# EAGLE design opencoral_moonlight (EAGLE 6.5.0)
TITLE: OpenCoral Luna Moonlight Strip
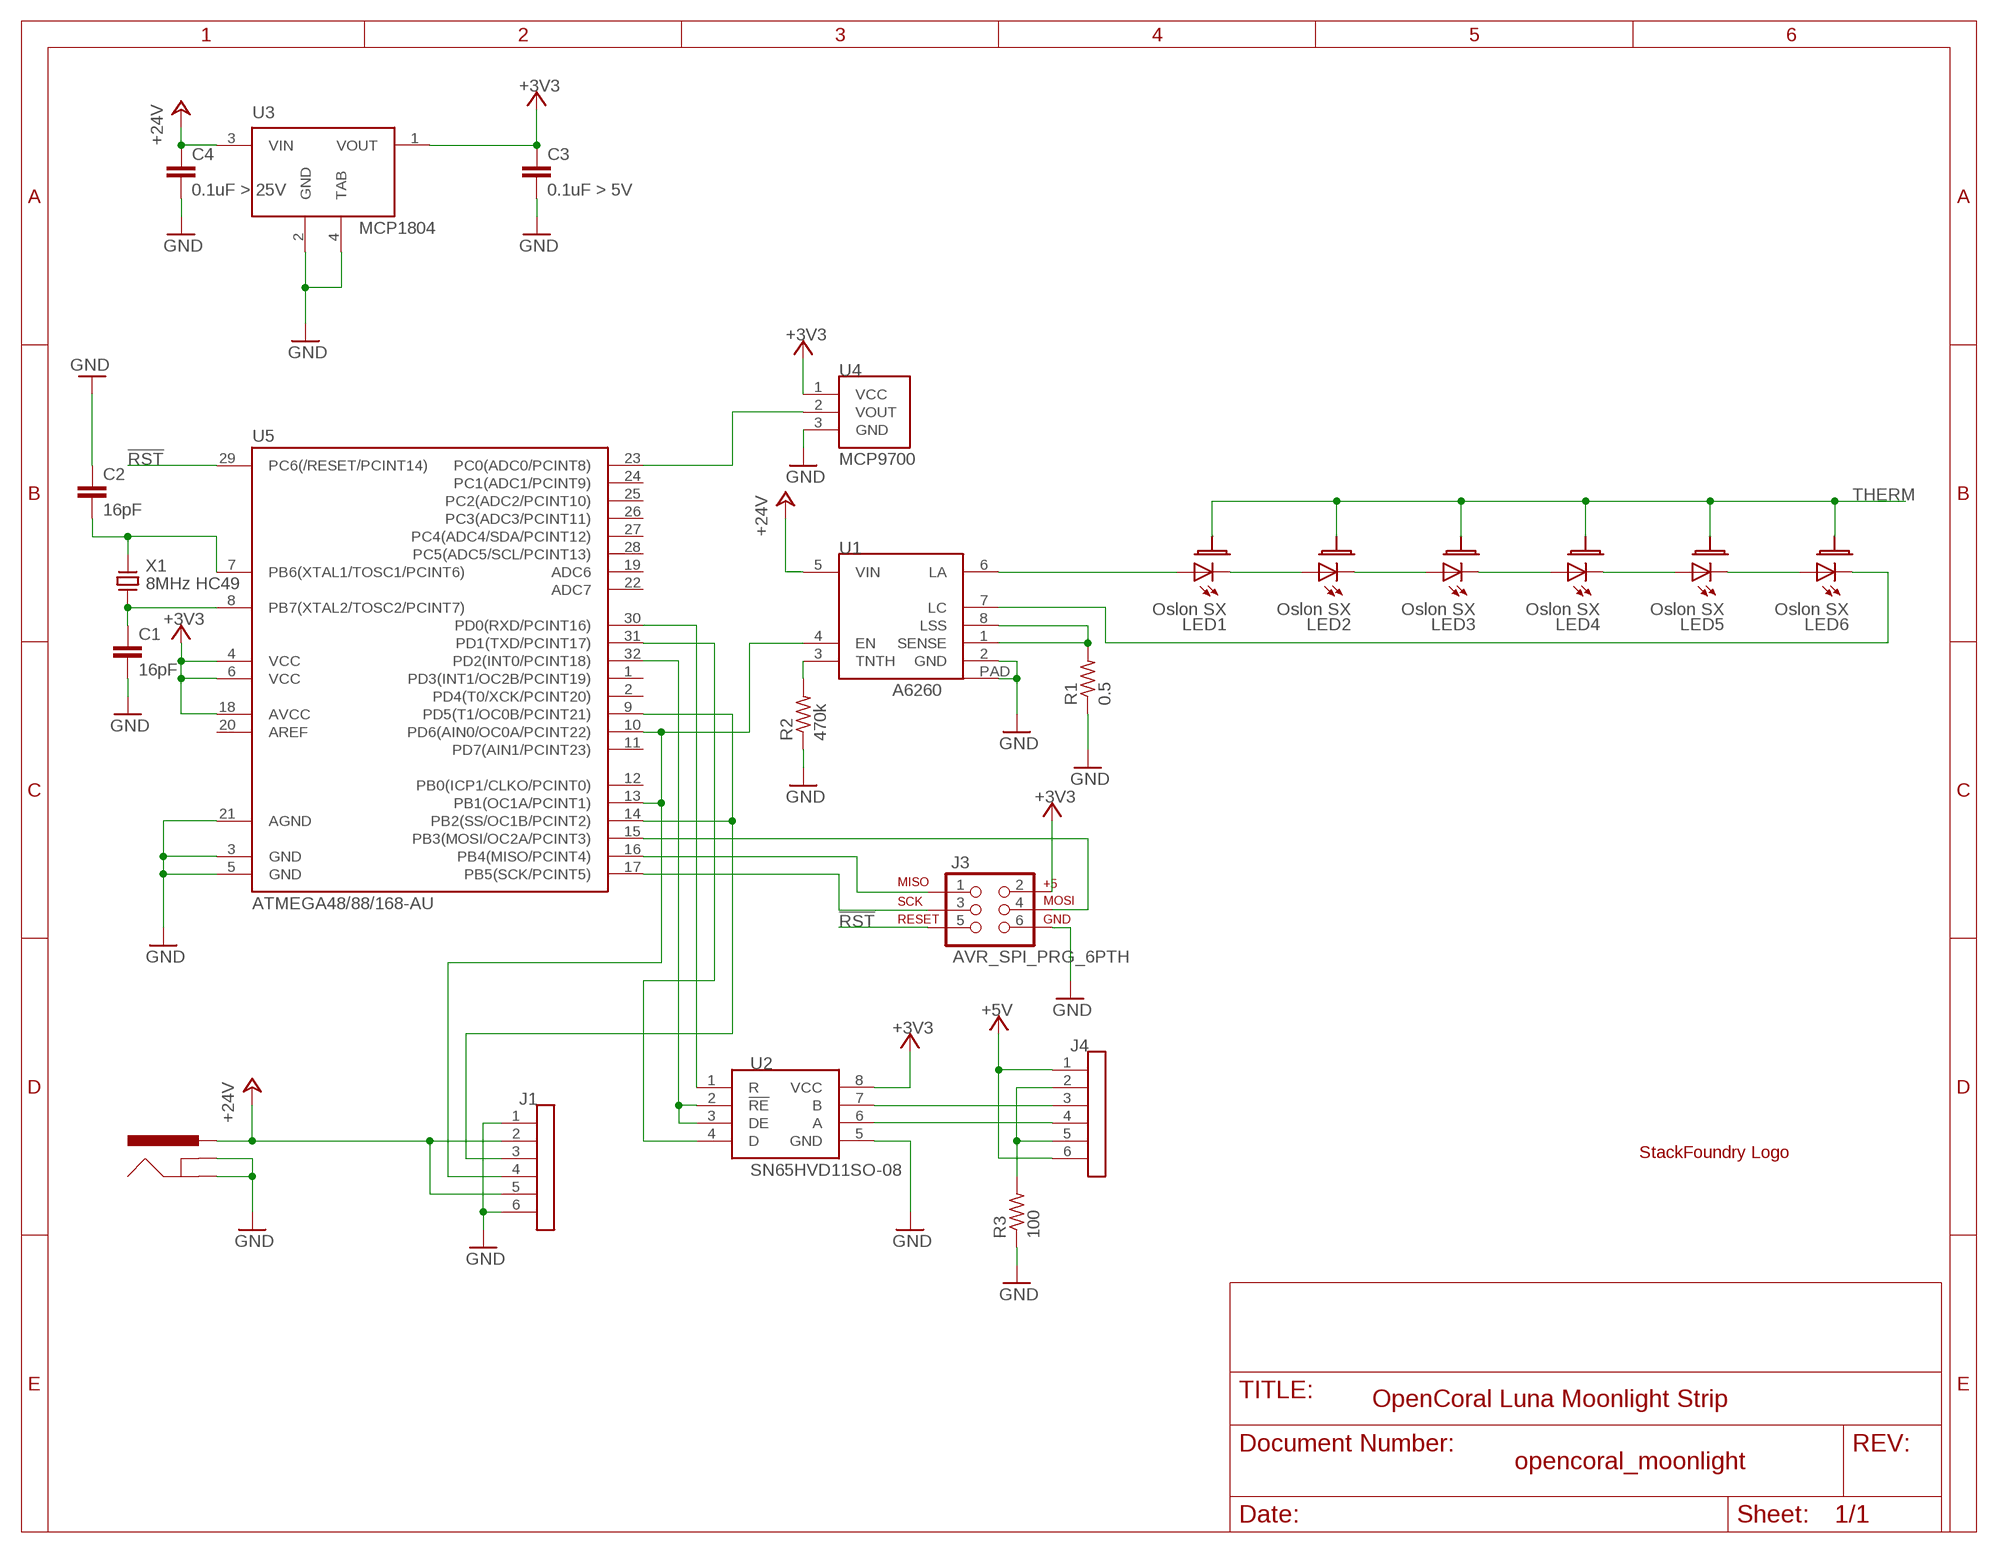
[diagram p0: schematic, sheet 1]

## Parts
C1  16pF  C-EUC0603  [C0603]
C2  16pF  C-EUC0603  [C0603]
C3  0.1uF > 5V  C-EUC0603  [C0603]
C4  0.1uF > 25V  C-EUC0603  [C0603]
J1  RJ12  [A-2004-RJ12]
J2  POWER_JACKPTH  [POWER_JACK_PTH]
J3  AVR_SPI_PRG_6PTH  [2X3]
J4  RJ12  [A-2004-RJ12]
LED1  Oslon SX  LEDOSLON_SX  [OSRAM_OSLON_SX]
LED2  Oslon SX  LEDOSLON_SX  [OSRAM_OSLON_SX]
LED3  Oslon SX  LEDOSLON_SX  [OSRAM_OSLON_SX]
LED4  Oslon SX  LEDOSLON_SX  [OSRAM_OSLON_SX]
LED5  Oslon SX  LEDOSLON_SX  [OSRAM_OSLON_SX]
LED6  Oslon SX  LEDOSLON_SX  [OSRAM_OSLON_SX]
LOGO1  SFLOGO  [SFLOGO]
R1  0.5  R-US_R0805  [R0805]
R2  470k  R-US_R0603  [R0603]
R3  100  R-US_R0603  [R0603]
U1  A6260  [ESOIC-8]
U2  SN65HVD11SO-08  [SO-08]
U3  MCP1804  [SOT223-3]
U4  MCP9700  [SOT23]
U5  ATMEGA48/88/168-AU  [TQFP32-08]
X1  8MHz HC49  HCM49_18.432M  [HCM49]

## Nets
!RST: J3.5 U5.29(PC6(/RESET/PCINT14))
+3V3: C3.1 J3.2 U2.8(VCC) U3.1(VOUT) U4.1(VCC) U5.4(VCC) U5.6(VCC) U5.18(AVCC)
+5V: J4.1 J4.6
+24V: C4.1 J1.2 J1.5 J2.PWR U1.5(VIN) U3.3(VIN)
GND: C1.2 C2.1 C3.2 C4.2 J1.1 J1.6 J2.GND J2.GNDBREAK J3.6 R1.1 R2.1 R3.1 U1.2(GND) U1.PAD U2.5(GND) U3.2(GND) U3.4(TAB) U4.3(GND) U5.3(GND) U5.5(GND) U5.21(AGND)
N$1: LED1.A U1.6(LA)
N$2: LED1.C LED2.A
N$3: LED2.C LED3.A
N$4: LED3.C LED4.A
N$5: LED4.C LED5.A
N$6: LED5.C LED6.A
N$7: LED6.C U1.7(LC)
N$8: J1.4 U1.4(EN) U5.10(PD6(AIN0/OC0A/PCINT22)) U5.13(PB1(OC1A/PCINT1))
N$9: U2.4(D) U5.31(PD1(TXD/PCINT17))
N$10: U2.1(R) U5.30(PD0(RXD/PCINT16))
N$11: R1.2 U1.1(SENSE) U1.8(LSS)
N$12: U2.2(!RE) U2.3(DE) U5.32(PD2(INT0/PCINT18))
N$13: J4.3 U2.7(B)
N$14: J4.4 U2.6(A)
N$15: R2.2 U1.3(TNTH)
N$16: J1.3 U5.9(PD5(T1/OC0B/PCINT21)) U5.14(PB2(SS/OC1B/PCINT2))
N$17: J3.4 U5.15(PB3(MOSI/OC2A/PCINT3))
N$18: J3.1 U5.16(PB4(MISO/PCINT4))
N$19: J3.3 U5.17(PB5(SCK/PCINT5))
N$20: C2.2 U5.7(PB6(XTAL1/TOSC1/PCINT6)) X1.P$1
N$21: C1.1 U5.8(PB7(XTAL2/TOSC2/PCINT7)) X1.P$2
N$22: U4.2(VOUT) U5.23(PC0(ADC0/PCINT8))
N$23: J4.2 J4.5 R3.2
THERM: LED1.THERM LED2.THERM LED3.THERM LED4.THERM LED5.THERM LED6.THERM
Unconnected: U5.1(PD3(INT1/OC2B/PCINT19)) U5.2(PD4(T0/XCK/PCINT20)) U5.11(PD7(AIN1/PCINT23)) U5.12(PB0(ICP1/CLKO/PCINT0)) U5.19(ADC6) U5.20(AREF) U5.22(ADC7) U5.24(PC1(ADC1/PCINT9)) U5.25(PC2(ADC2/PCINT10)) U5.26(PC3(ADC3/PCINT11)) U5.27(PC4(ADC4/SDA/PCINT12)) U5.28(PC5(ADC5/SCL/PCINT13))

## Library data of the parts
C1-C4 = rcl:C-EU: CAPACITOR, European symbol
J1 J4 = con-jack:RJ12
J2 = SparkFun:POWER_JACK: Power Jack This is the standard 5.5mm barrel jack for power. The PTH is the most common, proven, reliable, footprint. All others are experimental. The Slot footprint only works if the mill layer is transmitted to the PCB fab house so be warned. Spark Fun Electronics SKU : PRT-00119. Mating wall wart : TOL-00298 (and others)
J3 = SparkFun:AVR_SPI_PRG_6: AVR ISP 6 Pin This is the reduced ISP connector for AVR programming. Common on Arduino. This footprint will take up less PCB space and can be used with a 10-pin to 6-pin adapter such as SKU: BOB-08508
LED1-LED6 = high-power-led:LED
LOGO1 = logos:SFLOGO
R1-R3 = rcl:R-US_: RESISTOR, American symbol
U1 = allegro:A6260: Allegro A6260 Power LED Driver 350mA maximum output
U2 = texas:SN65HVD11: 3.3V RS-485 Transceiver, Half-Duplex
U3 = microchip:MCP1804
U4 = microchip:MCP9700: MCP9700 series temperature sensors -40-125C
U5 = atmel:ATMEGA48/88/168
X1 = xtal:HCM49_18.432M: 18.432 MHz SMD Crystal

## Board
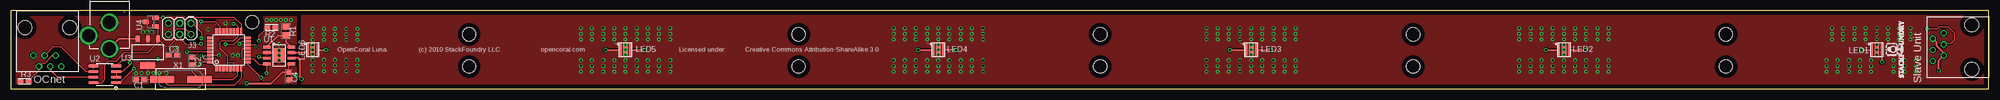
[diagram p1: board, top side]
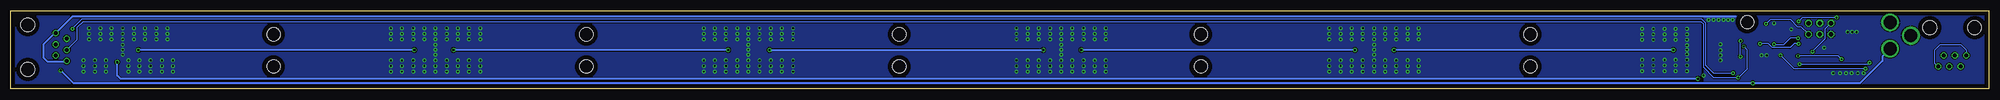
[diagram p2: board, bottom side, seen from below]

Size 449.58 x 17.78 mm. Coordinates in mm from the lower left corner, seen from the top.
Outline: 0,0 449.58,0 449.58,17.78 0,17.78 0,0
Copper layers (1*16): Top 0.035mm / dielectric 1.5mm / Bottom 0.035mm
Design rules "default *": minimum track width 10mil, minimum drill 15mil, track to track 8mil, track to pad 8mil, pad to pad 8mil, via to via 8mil, smd to smd 8mil, copper to edge 40mil, drill to drill 8mil, minimum pad ring 10mil, minimum via ring 8mil, stop-mask expansion 4mil, vias tented up to drill 15mil, thermal gap 10mil
Holes 3.05 mm at 54.86,15.24 104.14,12.45 179.07,5.08 247.65,12.45 318.77,5.08 389.89,12.45 389.89,5.08 104.14,5.08 179.07,12.45 247.65,5.08 318.77,12.45

### Footprints (pad centres in the part's own frame; a part is rotated, then mirrored left to right if it is on the bottom)
C0603 = smd 1.1 x 1: 1 -0.85,0; 2 0.85,0
A-2004-RJ12 = drill 0.9: 1 -5.08,0; 2 -3.81,-2.54; 3 -2.54,0; 4 -1.27,-2.54; 5 0,0; 6 1.27,-2.54 | hole 3.2: -6.99,-8.89; 3.18,-8.89
POWER_JACK_PTH = drill 2.997: GND 0,7.7; GNDBREAK 4.7,10.7; PWR 0,13.7
2X3 = drill 1.016 octagon: 1 0,0; 2 0,2.54; 3 2.54,0; 4 2.54,2.54; 5 5.08,0; 6 5.08,2.54
OSRAM_OSLON_SX = smd 2.8 x 0.55: A 0,-1.15; C 0,1.15 | smd 2.8 x 1: THERM 0,0
R0805 = smd 1.3 x 1.5: 1 -0.95,0; 2 0.95,0
R0603 = smd 1.1 x 1: 1 -0.85,0; 2 0.85,0
ESOIC-8 = smd 0.65 x 1.75: 1 -1.905,-2.8; 2 -0.635,-2.8; 3 0.635,-2.8; 4 1.905,-2.8; 5 1.905,2.8; 6 0.635,2.8; 7 -0.635,2.8; 8 -1.905,2.8 | smd 3.3 x 2.41: PAD 0,0
SO-08 = smd 0.6 x 2.2: 1 -1.905,-2.6; 2 -0.635,-2.6; 3 0.635,-2.6; 4 1.905,-2.6; 5 1.905,2.6; 6 0.635,2.6; 7 -0.635,2.6; 8 -1.905,2.6
SOT223-3 = smd 0.85 x 1.4: 1 -2.3,-3.04; 2 0,-3.04; 3 2.3,-3.04 | smd 3.4 x 1.6: 4 0,3.04
SOT23 = smd 1 x 1.4: 1 -0.95,-1.1; 2 0.95,-1.1; 3 0,1.1
TQFP32-08 = smd 1.27 x 0.559: 1 -4.293,2.8; 2 -4.293,2; 3 -4.293,1.2; 4 -4.293,0.4; 5 -4.293,-0.4; 6 -4.293,-1.2; 7 -4.293,-2; 8 -4.293,-2.8; 17 4.293,-2.8; 18 4.293,-2; 19 4.293,-1.2; 20 4.293,-0.4; 21 4.293,0.4; 22 4.293,1.2; 23 4.293,2; 24 4.293,2.8 | smd 0.559 x 1.27: 9 -2.8,-4.293; 10 -2,-4.293; 11 -1.2,-4.293; 12 -0.4,-4.293; 13 0.4,-4.293; 14 1.2,-4.293; 15 2,-4.293; 16 2.8,-4.293; 25 2.8,4.293; 26 2,4.293; 27 1.2,4.293; 28 0.4,4.293; 29 -0.4,4.293; 30 -1.2,4.293; 31 -2,4.293; 32 -2.8,4.293
HCM49 = smd 5.5 x 1.5: P$1 -4.25,0; P$2 4.25,0

### Placement (x,y rotation side)
C1  29.34,2.16 180 top
C2  41.15,6.35 270 top
C3  36.83,7.62 0 top
C4  63.12,2.92 270 top
J1  436.88,11.43 90 top
J2  22.35,22.86 180 top
J3  40.89,14.99 180 top
J4  6.35,5.08 180 top
LED1  424.18,8.89 90 top
LED2  353.06,8.89 90 top
LED3  281.94,8.89 90 top
LED4  210.82,8.89 90 top
LED5  139.7,8.89 90 top
LED6  68.58,8.89 90 top
LOGO1  430.28,2.54 90 top
R1  62.48,13.21 270 top
R2  59.18,13.97 180 top
R3  3.05,1.78 0 top
U1  60.96,7.62 270 top
U2  21.34,3.3 90 top
U3  31.12,8.38 180 top
U4  31.75,15.24 90 top
U5  49.53,8.89 90 top
X1  38.61,2.16 180 top

### Tracks (layer width: path | path; a pad name or v marks a point on that pad's centre or on a via)
!RST  (via drill 0.38)
  Top 0.254: v40.01,8.51 45.22,8.51 U5.29
  Bottom 0.254: 35.81,14.73 J3.5 37.08,13.72 37.08,11.43 v40.01,8.51
+3V3  (via drill 0.38)
  Top 0.254: 49.15,5.97 49.15,7.62 47.5,9.27 47.5,10.67 47.75,10.92 50.55,10.92 51.53,11.91 U5.18 51.56,13.21 51.56,14.22 50.93,14.86 v50.55,14.86 | U5.4 49.15,4.62 49.15,5.97 | 49.15,5.97 50.67,5.97 50.67,4.65 U5.6 | U2.8 20.57,1.4 21.34,2.16 21.34,5.46 22.23,6.35 23.88,6.35 25.78,8.26 31.12,8.26 33.85,10.99 | 35.98,9.82 C3.1 | 35.98,9.82 37.21,11.05 37.21,13.21 37.72,13.72 39.62,13.72 J3.2 | U4.1 33.41,14.29 U3.1 33.85,10.99 | 35.98,9.82 35.02,9.82 33.85,10.99
  Bottom 0.254: J3.2 42.55,14.1 43.31,14.1 44.96,15.75 49.66,15.75 v50.55,14.86
+5V
  Bottom 0.254: J4.6 5.08,8.89 6.35,10.16 10.92,10.16 12.19,8.89 12.19,5.84 J4.1
+24V  (via drill 0.38, 0.5)
  Top 0.254: C4.1 63.12,5.07 U1.5
  Top 0.406: v438.28,4.19 438.28,6.48 J1.2 439.42,8.13 437.77,9.78 437.77,10.54 J1.5 | U3.3 24.61,11.42 J2.PWR | v53.59,1.27 59.18,1.27 61.72,3.81 63.08,3.81 C4.1
  Bottom 0.406: v438.28,4.19 435.36,1.27 v53.59,1.27 29.21,1.27 24.13,6.35 24.13,7.38 J2.PWR
GND  (via drill 0.38)
  Top 0.406: U1.2 60.33,8.26 U1.PAD
  Bottom 0.406: 57.48,16.51 435.61,16.51 J1.6 439.67,12.7 442.21,10.16 442.21,7.11 441.33,6.22 437.01,6.22 J1.1
  other vias: 59.18,15.75 60.96,7.62 60.96,8.76 60.96,6.48 51.56,7.62 62.48,15.75 61.34,15.75 63.63,15.75 64.77,3.05 48.77,14.99 44.83,13.59 60.2,15.75 50.42,7.62 31.12,3.56 29.72,3.56 32.39,3.56 33.78,3.56 60.96,10.16 58.17,15.75 37.34,9.4 35.31,3.56 28.45,3.56 30.99,12.95 29.97,12.95 32,12.95
  pour Top (rank 2): 0,16.51 64.77,16.51 64.77,0 0,0
  pour Bottom: 64.77,17.78 64.77,0 0,0 0,17.78
N$1  (via drill 0.5)
  Top 0.406: U1.6 65.41,6.99 65.79,6.6 65.79,2.54 v66.04,2.29 | v425.45,6.1 425.45,8.77 LED1.A
  Bottom 0.406: v66.04,2.29 424.69,2.29 425.45,3.05 v425.45,6.1
N$2  (via drill 0.5)
  Top 0.406: LED2.A v357.89,8.89 | v420.62,8.89 LED1.C
  Bottom 0.406: v357.89,8.89 v420.62,8.89
N$3  (via drill 0.5)
  Top 0.406: LED3.A v286.51,8.89 | v349,8.89 LED2.C
  Bottom 0.406: v286.51,8.89 v349,8.89
N$4  (via drill 0.5)
  Top 0.406: v214.88,8.89 LED4.A | v277.11,8.89 LED3.C
  Bottom 0.406: v277.11,8.89 v214.88,8.89
N$5  (via drill 0.5)
  Top 0.406: LED5.A v144.02,8.89 | v206.25,8.89 LED4.C
  Bottom 0.406: v144.02,8.89 v206.25,8.89
N$6  (via drill 0.5)
  Top 0.406: LED6.A v71.63,8.89 | v135.13,8.89 LED5.C
  Bottom 0.406: v71.63,8.89 v135.13,8.89
N$7
  Top 0.406: U1.7 66.8,8.26 LED6.C
N$8  (via drill 0.38)
  Top 0.254: v58.04,3.56 58.16,3.68 U1.4 58.03,5.59 56.39,5.59 55.09,6.89 U5.10 53.79,6.86 52.7,6.86 52.58,6.99 52.58,9.02 52.85,9.29 U5.13 | v435.61,13.72 438.02,13.72 438.53,14.22 440.31,14.22 441.83,12.7 441.83,11.18 440.94,10.29 439.55,10.29 J1.4
  Bottom 0.254: v58.04,3.56 62.48,3.56 64.26,5.33 64.26,14.99 65.15,15.88 433.45,15.88 v435.61,13.72
N$9  (via drill 0.38)
  Top 0.254: U5.31 45.2,6.86 43.94,6.86 v43.31,7.49 | 24.06,5.08 U2.4 25.46,6.73 v33.4,6.73
  Bottom 0.254: v43.31,7.49 34.16,7.49 v33.4,6.73
N$10  (via drill 0.38)
  Top 0.254: v47.24,7.62 45.31,7.62 U5.30 | U2.1 24.77,1.4 v27.94,4.57
  Bottom 0.254: v47.24,7.62 44.2,4.57 v27.94,4.57
N$11
  Top 0.406: U1.1 58.16,9.65 60.71,12.19 62.42,12.19 R1.2 62.48,10.8 U1.8
N$12  (via drill 0.38)
  Top 0.254: U5.32 43.43,6.09 v42.93,5.59 | v27.05,5.97 27.05,5.59 25.4,3.94 U2.3 U2.2
  Bottom 0.254: v42.93,5.59 27.43,5.59 v27.05,5.97
N$13
  Top 0.254: J4.3 8.89,4.32 10.54,2.67 U2.7
N$14
  Top 0.254: J4.4 9.65,9.65 11.3,9.65 17.02,3.94 U2.6
N$15  (via drill 0.38)
  Top 0.254: U1.3 56.77,6.99 v56.39,7.37 | v56.39,10.92 56.39,12.1 R2.2
  Bottom 0.254: v56.39,7.37 v56.39,10.92
N$16  (via drill 0.38)
  Top 0.254: U5.9 53.82,5.61 v56.9,2.54 | v55.63,9.65 55.63,10.03 53.88,10.03 U5.14
  Bottom 0.254: J1.3 434.59,11.18 434.59,13.97 433.32,15.24 65.28,15.24 64.77,14.73 64.77,4.83 62.48,2.54 v56.9,2.54 54.86,4.57 54.86,8.89 v55.63,9.65
N$17  (via drill 0.38)
  Top 0.254: J3.4 38.35,11.68 39.88,10.16 43.05,10.16 v43.18,10.29 | U5.15 53.79,10.92 52.58,10.92 v51.94,10.29
  Bottom 0.254: v43.18,10.29 44.2,10.29 45.09,9.4 49.15,9.4 50.04,10.29 v51.94,10.29
N$18  (via drill 0.38)
  Top 0.254: J3.1 41.15,14.99 43.31,12.83 v43.31,11.56 | U5.16 52.2,11.68 50.67,10.16 v48.77,10.16
  Bottom 0.254: v43.31,11.56 45.09,11.56 46.61,10.03 48.64,10.03 v48.77,10.16
N$19
  Top 0.254: J3.3 38.61,14.99 40.01,16.38 50.67,16.38 52.32,14.73 U5.17 52.45,13.3
N$20
  Top 0.254: U5.7 51.56,4.57 51.56,3.17 50.55,2.16 X1.P$1 41.15,3.87 C2.2
N$21
  Top 0.254: U5.8 52.45,4.48 52.45,2.54 50.8,0.89 35.63,0.89 X1.P$2 | X1.P$2 34.36,1.84 | C1.1 X1.P$2
N$22  (via drill 0.38)
  Top 0.254: U4.2 34.48,16.19 v34.54,16.26 | v43.18,15.37 46.48,15.37 47.5,14.35 47.5,13.21 U5.23
  Bottom 0.254: v34.54,16.26 42.29,16.26 v43.18,15.37
N$23
  Top 0.254: J4.2 9.4,7.62 7.62,5.84 7.11,5.84 J4.5 6.35,4.23 R3.2
THERM  (via drill 0.38)
  other vias: 68.58,9.91 68.58,8.89 68.58,7.87 139.7,10.03 139.7,8.89 139.7,7.75 210.82,10.03 210.82,8.89 210.82,7.75 281.94,10.03 281.94,8.89 281.94,7.75 353.06,10.03 353.06,8.89 353.06,7.75 424.18,10.03 424.18,8.89 424.18,7.75 68.58,13.72 68.58,12.45 68.58,11.18 68.58,6.6 68.58,5.33 68.58,4.06 139.7,11.3 139.7,12.57 139.7,13.84 139.7,6.48 139.7,5.21 139.7,3.94 210.82,11.3 210.82,12.57 210.82,13.84 210.82,6.48 210.82,5.21 210.82,3.94 281.94,11.3 281.94,12.57 281.94,13.84 281.94,6.48 281.94,5.21 281.94,3.94 353.06,11.3 353.06,12.57 353.06,13.84 353.06,6.48 353.06,5.21 353.06,3.94 424.18,11.3 424.18,12.57 424.18,13.84 422.91,6.48 422.91,5.21 422.91,3.94 71.12,13.72 73.66,13.72 76.2,13.72 78.74,13.72 71.12,11.18 73.66,11.18 76.2,11.18 78.74,11.18 71.12,6.6 73.66,6.6 76.2,6.6 78.74,6.6 71.12,4.06 73.66,4.06 76.2,4.06 78.74,4.06 137.16,13.84 134.62,13.84 132.08,13.84 129.54,13.84 137.16,11.3 134.62,11.3 132.08,11.3 129.54,11.3 137.16,6.48 134.62,6.48 132.08,6.48 129.54,6.48 137.16,3.94 134.62,3.94 132.08,3.94 129.54,3.94 142.24,13.84 144.78,13.84 147.32,13.84 149.86,13.84 142.24,11.3 144.78,11.3 147.32,11.3 149.86,11.3 142.24,6.48 144.78,6.48 147.32,6.48 149.86,6.48 142.24,3.94 144.78,3.94 147.32,3.94 149.86,3.94 208.28,13.84 205.74,13.84 203.2,13.84 200.66,13.84 208.28,11.3 205.74,11.3 203.2,11.3 200.66,11.3 213.36,13.84 215.9,13.84 218.44,13.84 220.98,13.84 213.36,11.3 215.9,11.3 218.44,11.3 220.98,11.3 213.36,6.48 215.9,6.48 218.44,6.48 220.98,6.48 213.36,3.94 215.9,3.94 218.44,3.94 220.98,3.94 208.28,6.48 205.74,6.48 203.2,6.48 200.66,6.48 208.28,3.94 205.74,3.94 203.2,3.94 200.66,3.94 284.48,13.84 287.02,13.84 289.56,13.84 292.1,13.84 284.48,11.3 287.02,11.3 289.56,11.3 292.1,11.3 284.48,6.48 287.02,6.48 289.56,6.48 292.1,6.48 284.48,3.94 287.02,3.94 289.56,3.94 292.1,3.94 279.4,13.84 276.86,13.84 274.32,13.84 271.78,13.84 279.4,11.3 276.86,11.3 274.32,11.3 271.78,11.3 279.4,6.48 276.86,6.48 274.32,6.48 271.78,6.48 279.4,3.94 276.86,3.94 274.32,3.94 271.78,3.94 355.6,13.84 358.14,13.84 360.68,13.84 363.22,13.84 355.6,11.3 358.14,11.3 360.68,11.3 363.22,11.3 355.6,6.48 358.14,6.48 360.68,6.48 363.22,6.48 355.6,3.94 358.14,3.94 360.68,3.94 363.22,3.94 350.52,3.94 347.98,3.94 345.44,3.94 342.9,3.94 350.52,6.48 347.98,6.48 345.44,6.48 342.9,6.48 350.52,13.84 347.98,13.84 345.44,13.84 342.9,13.84 350.52,11.3 347.98,11.3 345.44,11.3 342.9,11.3 426.72,13.84 429.26,13.84 431.8,13.84 426.72,11.3 429.26,11.3 431.8,11.3 421.64,13.84 419.1,13.84 416.56,13.84 414.02,13.84 421.64,11.3 419.1,11.3 416.56,11.3 414.02,11.3 420.37,6.48 417.83,6.48 415.29,6.48 412.75,6.48 420.37,5.21 417.83,5.21 415.29,5.21 412.75,5.21 420.37,3.94 417.83,3.94 415.29,3.94 412.75,3.94 71.12,5.33 73.66,5.33 76.2,5.33 78.74,5.33 71.12,12.45 73.66,12.45 76.2,12.45 78.74,12.45 137.16,12.57 134.62,12.57 132.08,12.57 129.54,12.57 142.24,12.57 144.78,12.57 147.32,12.57 149.86,12.57 137.16,5.21 134.62,5.21 132.08,5.21 129.54,5.21 142.24,5.21 144.78,5.21 147.32,5.21 149.86,5.21 213.36,12.57 215.9,12.57 218.44,12.57 220.98,12.57 208.28,12.57 205.74,12.57 203.2,12.57 200.66,12.57 208.28,5.21 205.74,5.21 203.2,5.21 200.66,5.21 213.36,5.21 215.9,5.21 218.44,5.21 220.98,5.21 284.48,5.21 287.02,5.21 289.56,5.21 292.1,5.21 279.4,5.21 276.86,5.21 274.32,5.21 271.78,5.21 284.48,12.57 287.02,12.57 289.56,12.57 292.1,12.57 279.4,12.57 276.86,12.57 274.32,12.57 271.78,12.57 355.6,12.57 358.14,12.57 360.68,12.57 363.22,12.57 350.52,12.57 347.98,12.57 345.44,12.57 342.9,12.57 355.6,5.21 358.14,5.21 360.68,5.21 363.22,5.21 350.52,5.21 347.98,5.21 345.44,5.21 342.9,5.21 421.64,12.57 419.1,12.57 416.56,12.57 414.02,12.57 426.72,12.57 429.26,12.57 431.8,12.57 427.99,6.48 430.53,6.48 433.07,6.48 427.99,5.21 427.99,3.94 430.53,5.21 430.53,3.94 433.07,5.21 433.07,3.94
  pour Top (no thermals): 66.04,25.4 66.04,0 449.58,0 449.58,25.4
  pour Bottom (rank 2): 65.53,25.4 65.53,0 449.58,0 449.58,25.4

### Text on the board
tPlace: OCnet | Slave Unit
tNames: OpenCoral Luna | (c) 2010 StackFoundry LLC | opencoral.com | Licensed under: | Creative Commons Attribution-ShareAlike 3.0